# EAGLE design main (EAGLE 6.6.0)
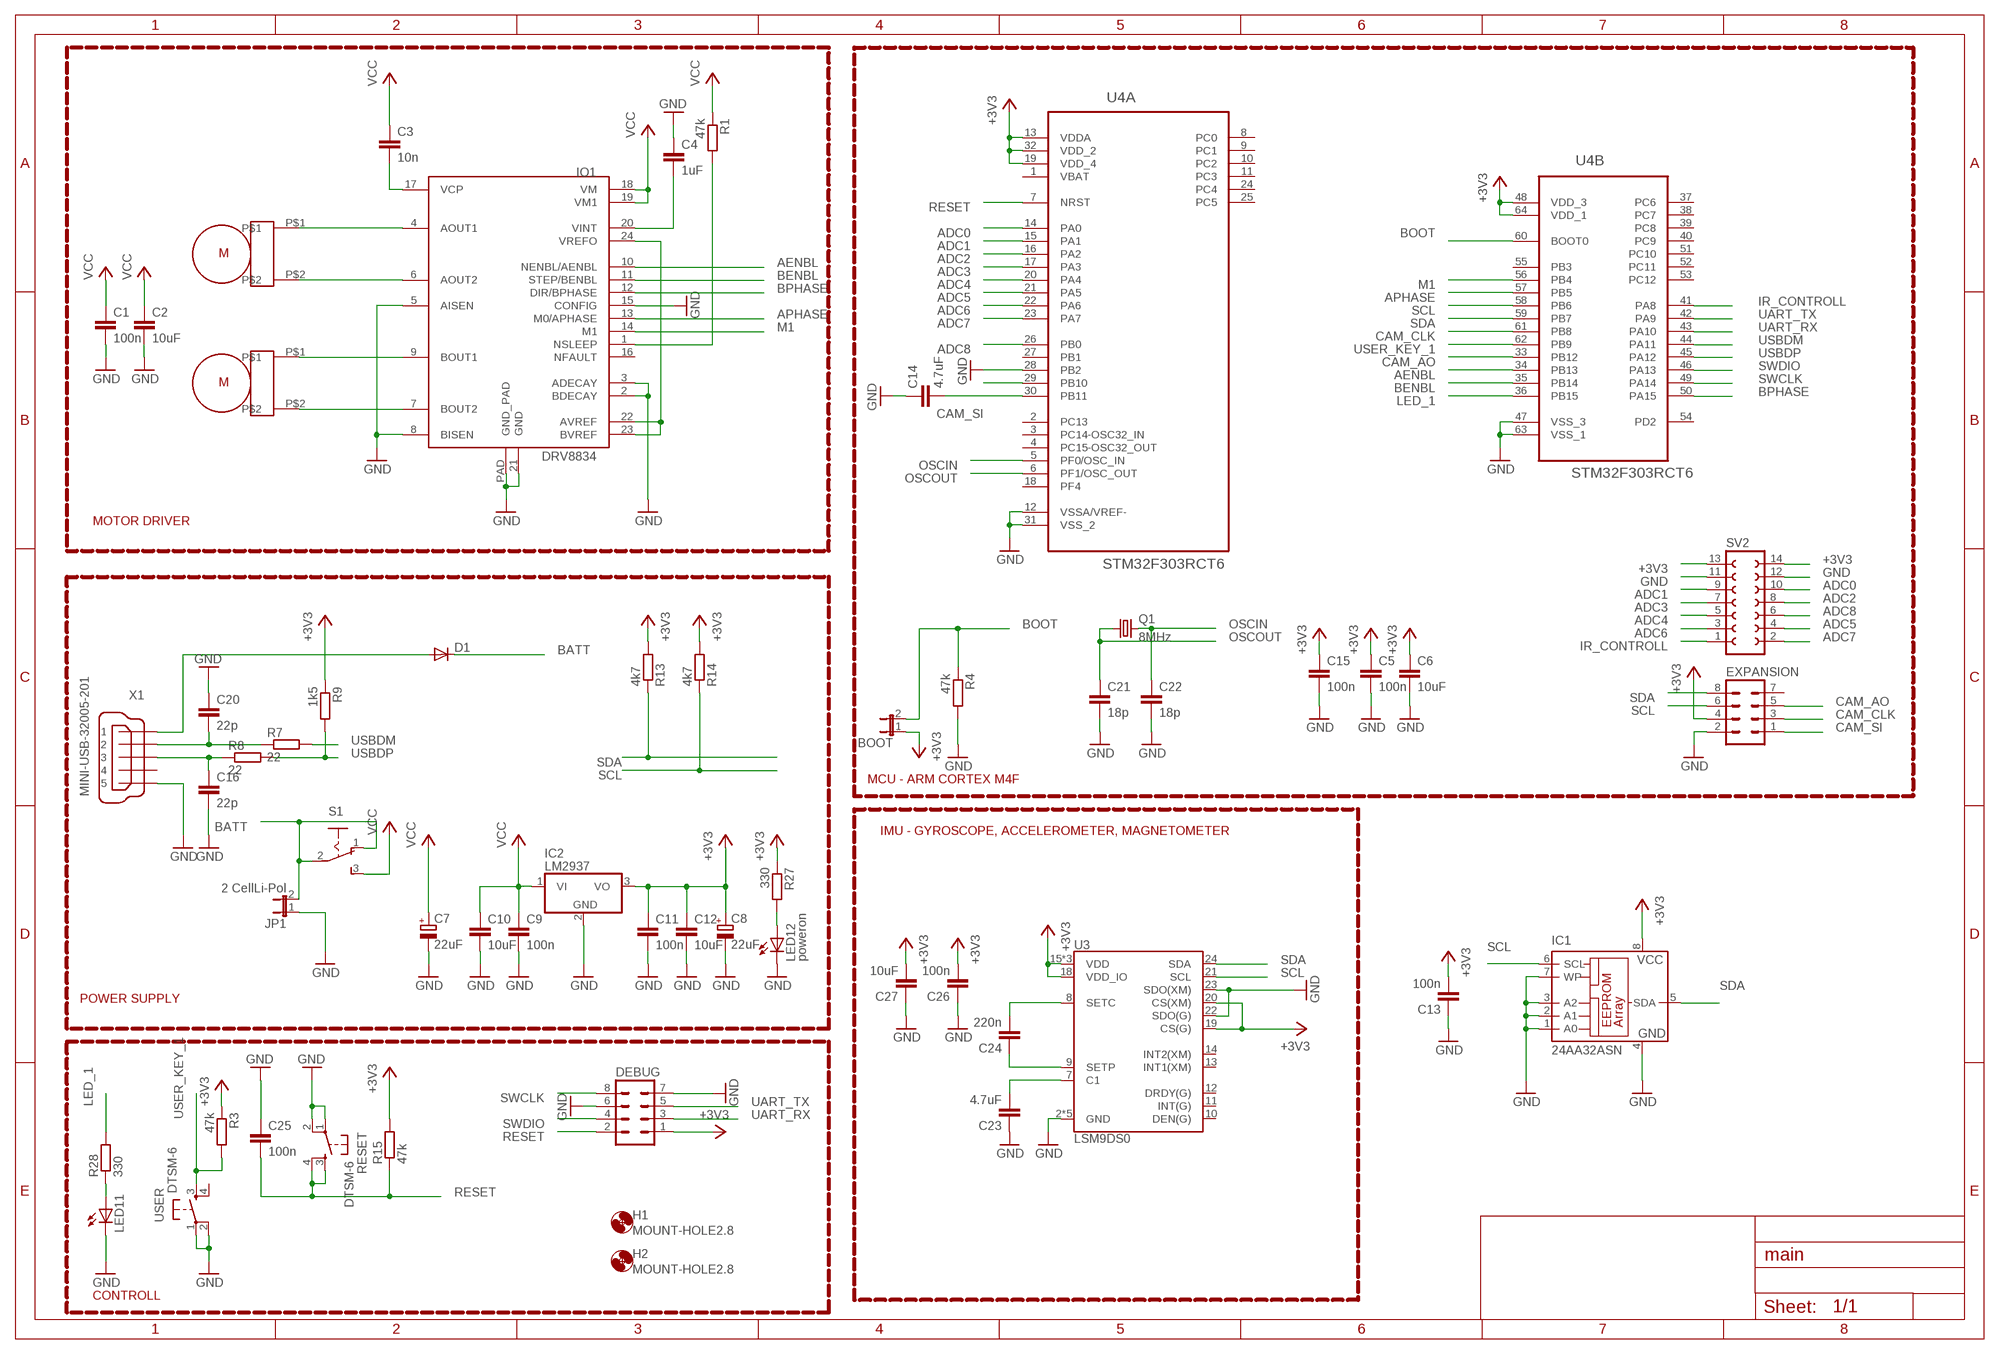
[diagram p0: schematic, sheet 1]

## Parts
BOOT  JP1E  [JP1]
C1  100n  C-EUC1206  [C1206]
C2  10uF  C-EUC1206  [C1206]
C3  10n  C-EUC1206  [C1206]
C4  1uF  C-EUC1206  [C1206]
C5  100n  C-EUC0805  [C0805]
C6  10uF  C-EUC0805  [C0805]
C7  22uF  CPOL-EU153CLV-0505  [153CLV-0505]
C8  22uF  CPOL-EU153CLV-0505  [153CLV-0505]
C9  100n  C-EUC0805  [C0805]
C10  10uF  C-EUC0805  [C0805]
C11  100n  C-EUC0805  [C0805]
C12  10uF  C-EUC0805  [C0805]
C13  100n  C-EUC0805  [C0805]
C14  4.7uF  C-EUC0805  [C0805]
C15  100n  C-EUC0805  [C0805]
C16  22p  C-EUC0805  [C0805]
C20  22p  C-EUC0805  [C0805]
C21  18p  C-EUC0805  [C0805]
C22  18p  C-EUC0805  [C0805]
C23  4.7uF  C-EUC0805  [C0805]
C24  220n  C-EUC0805  [C0805]
C25  100n  C-EUC0805  [C0805]
C26  100n  C-EUC0805  [C0805]
C27  10uF  C-EUC0805  [C0805]
D1  DIODE-SMB  [SMB]
DEBUG  MA04-2  [MA04-2]
EXPANSION  MA04-2  [MA04-2]
H1  MOUNT-HOLE2.8  [2,8]
H2  MOUNT-HOLE2.8  [2,8]
IC1  24AA32ASN  [SO-08]
IC2  LM2937  [TO263-3]
IO1  DRV8834  [DRV8834_PCK]
JP1  2 CellLi-Pol  JP1E  [JP1]
LED11  LEDCHIPLED_1206  [CHIPLED_1206]
LED12  poweron  LEDCHIPLED_1206  [CHIPLED_1206]
Q1  8MHz  CRYSTALCTS406  [CTS406]
R1  47k  R-EU_M1206  [M1206]
R3  47k  R-EU_M0805  [M0805]
R4  47k  R-EU_M0805  [M0805]
R7  22  R-EU_M0805  [M0805]
R8  22  R-EU_M0805  [M0805]
R9  1k5  R-EU_M0805  [M0805]
R13  4k7  R-EU_M0805  [M0805]
R14  4k7  R-EU_M0805  [M0805]
R15  47k  R-EU_M0805  [M0805]
R27  330  R-EU_M0805  [M0805]
R28  330  R-EU_M0805  [M0805]
RESET  DTSM-6  [DTSM-6]
S1  255SB  [255SB]
SV2  FE07-2  [FE07-2]
U3  LSM9DS0  [LGA-24]
U4  STM32F303RCT6  [QFP50P1200X1200X160-64N]
U$1  MICRO_METAL_GEAR_MOTOR  [MICRO_METAL_GEAR_MOTOR]
U$2  MICRO_METAL_GEAR_MOTOR  [MICRO_METAL_GEAR_MOTOR]
USER  DTSM-6  [DTSM-6]
X1  MINI-USB-32005-201  [32005-201]

## Nets
+3V3: BOOT.1 C5.1 C6.1 C8.+ C11.1 C12.1 C13.2 C15.1 C26.2 C27.2 DEBUG.1 EXPANSION.4 IC1.8(VCC) IC2.3(VO) R3.1 R9.1 R13.2 R14.2 R15.2 R27.1 SV2.13 SV2.14 U3.15(VDD) U3.16(VDD) U3.17(VDD) U3.18(VDD_IO) U3.19(CS(G)) U3.20(CS(XM)) U4.13(A:VDDA) U4.19(A:VDD_4) U4.32(A:VDD_2) U4.48(B:VDD_3) U4.64(B:VDD_1)
ADC0: SV2.10 U4.14(A:PA0)
ADC1: SV2.9 U4.15(A:PA1)
ADC2: SV2.8 U4.16(A:PA2)
ADC3: SV2.7 U4.17(A:PA3)
ADC4: SV2.5 U4.20(A:PA4)
ADC5: SV2.4 U4.21(A:PA5)
ADC6: SV2.3 U4.22(A:PA6)
ADC7: SV2.2 U4.23(A:PA7)
ADC8: SV2.6 U4.26(A:PB0)
AENBL: IO1.10(NENBL/AENBL) U4.34(B:PB13)
APHASE: IO1.13(M0/APHASE) U4.57(B:PB5)
BATT: D1.C JP1.2 S1.1(O) S1.2(P)
BENBL: IO1.11(STEP/BENBL) U4.35(B:PB14)
BOOT: BOOT.2 R4.1 U4.60(B:BOOT0)
BPHASE: IO1.12(DIR/BPHASE) U4.50(B:PA15)
CAM_AO: EXPANSION.5 U4.33(B:PB12)
CAM_CLK: EXPANSION.3 U4.61(B:PB8)
CAM_SI: EXPANSION.1 U4.29(A:PB10)
GND: C1.2 C2.2 C4.1 C5.2 C6.2 C7.- C8.- C9.2 C10.2 C11.2 C12.2 C13.1 C14.1 C15.2 C16.2 C20.1 C21.2 C22.2 C23.1 C25.1 C26.1 C27.1 DEBUG.6 DEBUG.7 EXPANSION.2 IC1.1(A0) IC1.2(A1) IC1.3(A2) IC1.4(GND) IC1.7(WP) IC2.2(GND) IO1.2(BDECAY) IO1.3(ADECAY) IO1.5(AISEN) IO1.8(BISEN) IO1.15(CONFIG) IO1.21(GND) IO1.PAD(GND_PAD) JP1.1 LED11.C LED12.C R4.2 RESET.1 RESET.2 SV2.11 SV2.12 U3.2(GND) U3.3(GND) U3.4(GND) U3.5(GND) U3.6(GND) U3.22(SDO(G)) U3.23(SDO(XM)) U4.12(A:VSSA/VREF-) U4.28(A:PB2) U4.31(A:VSS_2) U4.47(B:VSS_3) U4.63(B:VSS_1) USER.1 USER.2 X1.5
IR_CONTROLL: SV2.1 U4.41(B:PA8)
LED_1: R28.2 U4.36(B:PB15)
M1: IO1.14(M1) U4.56(B:PB4)
N$1: IO1.4(AOUT1) U$1.P$1
N$2: IO1.6(AOUT2) U$1.P$2
N$3: IO1.9(BOUT1) U$2.P$1
N$4: IO1.7(BOUT2) U$2.P$2
N$5: C3.2 IO1.17(VCP)
N$6: C23.2 U3.7(C1)
N$7: C24.2 U3.8(SETC)
N$8: IO1.22(AVREF) IO1.23(BVREF) IO1.24(VREFO)
N$9: IO1.1(NSLEEP) R1.2
N$13: C24.1 U3.9(SETP)
N$15: C14.2 U4.30(A:PB11)
N$22: C4.2 IO1.20(VINT)
N$23: LED12.A R27.2
N$33: LED11.A R28.1
N$55: C20.2 R7.1 X1.2
N$56: C16.1 R8.1 X1.3
N$57: D1.A X1.1
OSCIN: C22.1 Q1.3 U4.5(A:PF0/OSC_IN)
OSCOUT: C21.1 Q1.1 U4.6(A:PF1/OSC_OUT)
RESET: C25.2 DEBUG.2 R15.1 RESET.3 RESET.4 U4.7(A:NRST)
SCL: EXPANSION.6 IC1.6(SCL) R14.1 U3.21(SCL) U4.58(B:PB6)
SDA: EXPANSION.8 IC1.5(SDA) R13.1 U3.24(SDA) U4.59(B:PB7)
SWCLK: DEBUG.8 U4.49(B:PA14)
SWDIO: DEBUG.4 U4.46(B:PA13)
UART_RX: DEBUG.3 U4.43(B:PA10)
UART_TX: DEBUG.5 U4.42(B:PA9)
USBDM: R7.2 U4.44(B:PA11)
USBDP: R8.2 R9.2 U4.45(B:PA12)
USER_KEY_1: R3.2 U4.62(B:PB9) USER.3
VCC: C1.1 C2.1 C3.1 C7.+ C9.1 C10.1 IC2.1(VI) IO1.18(VM) IO1.19(VM1) R1.1 S1.3(S)
Unconnected: EXPANSION.7 IO1.16(NFAULT) U3.10(DEN(G)) U3.11(INT(G)) U3.12(DRDY(G)) U3.13(INT1(XM)) U3.14(INT2(XM)) U4.2(A:PC13) U4.3(A:PC14-OSC32_IN) U4.4(A:PC15-OSC32_OUT) U4.8(A:PC0) U4.9(A:PC1) U4.10(A:PC2) U4.11(A:PC3) U4.18(A:PF4) U4.24(A:PC4) U4.25(A:PC5) U4.27(A:PB1) U4.37(B:PC6) U4.38(B:PC7) U4.39(B:PC8) U4.40(B:PC9) U4.51(B:PC10) U4.52(B:PC11) U4.53(B:PC12) U4.54(B:PD2) U4.55(B:PB3) USER.4 X1.4

## Notes on the sheet
- MOTOR DRIVER
- MCU - ARM CORTEX M4F
- IMU - GYROSCOPE, ACCELEROMETER, MAGNETOMETER
- POWER SUPPLY
- CONTROLL

## Power pins joined to a net without a drawn wire
VBAT: U4.1(A:VBAT)

## Library data of the parts
BOOT JP1 = jumper:JP1E: JUMPER
C1-C6 C9-C16 C20-C27 = resistor:C-EU: CAPACITOR, European symbol
C7 C8 = resistor:CPOL-EU: POLARIZED CAPACITOR, European symbol
D1 = diode:DIODE-: DIODE
DEBUG EXPANSION = con-lstb:MA04-2: PIN HEADER; OC_FARNELL: unknown; OC_NEWARK: unknown
H1 H2 = holes:MOUNT-HOLE: MOUNTING HOLE with drill center marker
IC1 = microchip:24*: Serial EEPROM I2C; MF: MICROCHIP; MPN: 24AA32A-I/SN; OC_FARNELL: 1617659; OC_NEWARK: 83C5815
IC2 = linear:LM2937: LM2937-2.5, LM2937-3.3 400mA and 500mA Voltage Regulators Source: http://cache.national.com/ds/LM/LM2937-2.5.pdf
IO1 = yellow_car:DRV8834
LED11 LED12 = led:LED: LED OSRAM: - CHIPLED LG R971, LG N971, LY N971, LG Q971, LY Q971, LO R971, LY R971 LH N974, LH R974 LS Q976, LO Q976, LY Q976 LO Q996 - Hyper CHIPLED LW Q18S LB Q993, LB Q99A, LB R99A - SideLED LS A670, LO A670, LY A670, LG A670, LP A670 LB A673, LV A673, LT A673, LW A673 LH A674 LY A675 LS A676, LA A676, LO A676, LY A676, LW A676 LS A679, LY A679, LG A679 - Hyper Micro SIDELED® LS Y876, LA Y876, LO Y876, LY Y876 LT Y87S - SmartLED LW L88C, LW L88S LB L89C, LB L89S, LG L890 LS L89K, LO L89K, LY L89K LS L896, LA L896, LO L896, LY L896 - TOPLED LS T670, LO T670, LY T670, LG T670, LP T670 LSG T670, LSP T670, LSY T670, LOP T670, LYG T670 LG T671, LOG T671, LSG T671 LB T673, LV T673, LT T673, LW T673 LH T674 LS T676, LA T676, LO T676, LY T676, LB T676, LH T676, LSB T676, LW T676 LB T67C, LV T67C, LT T67C, LS T67K, LO T67K, LY T67K, LW E67C LS E67B, LA E67B, LO E67B, LY E67B, LB E67C, LV E67C, LT E67C LW T67C LS T679, LY T679, LG T679 LS T770, LO T770, LY T770, LG T770, LP T770 LB T773, LV T773, LT T773, LW T773 LH T774 LS E675, LA E675, LY E675, LS T675 LS T776, LA T776, LO T776, LY T776, LB T776 LHGB T686 LT T68C, LB T68C - Hyper Mini TOPLED® LB M676 - Mini TOPLED Santana® LG M470 LS M47K, LO M47K, LY M47K Source: http://www.osram.convergy.de LUXEON: - LUMILED® LXK2-PW12-R00, LXK2-PW12-S00, LXK2-PW14-U00, LXK2-PW14-V00 LXK2-PM12-R00, LXK2-PM12-S00, LXK2-PM14-U00 LXK2-PE12-Q00, LXK2-PE12-R00, LXK2-PE12-S00, LXK2-PE14-T00, LXK2-PE14-U00 LXK2-PB12-K00, LXK2-PB12-L00, LXK2-PB12-M00, LXK2-PB14-N00, LXK2-PB14-P00, LXK2-PB14-Q00 LXK2-PR12-L00, LXK2-PR12-M00, LXK2-PR14-Q00, LXK2-PR14-R00 LXK2-PD12-Q00, LXK2-PD12-R00, LXK2-PD12-S00 LXK2-PH12-R00, LXK2-PH12-S00 LXK2-PL12-P00, LXK2-PL12-Q00, LXK2-PL12-R00 Source: www.luxeon.com KINGBRIGHT: KA-3528ASYC Source: www.kingbright.com
Q1 = crystal:CRYSTAL: CRYSTAL; OC_FARNELL: unknown; OC_NEWARK: unknown
R1 R3 R4 R7-R9 R13-R15 R27 R28 = resistor:R-EU_: RESISTOR, European symbol
RESET USER = switch-tact:DTSM-6
S1 = switch:255SB: SLIDING SWITCH Distributor Buerklin, 11G810
SV2 = con-lsta:FE07-2: FEMALE HEADER; OC_FARNELL: unknown; OC_NEWARK: unknown
U3 = SparkFun-DigitalIC:LSM9DS0: LSM9DS0 3D Accelerometer, 3D Gyroscope, 3D Magnetomter Features: 3 acceleration channels, 3 angular rate channels, 3 magnetic field channels ±2/±4/±6/±8/±16 g linear acceleration full scale ±2/±4/±8/±12 gauss magnetic full scale ±245/±500/±2000 dps angular rate full scale 16-bit data output SPI / I2C serial interfaces Analog supply voltage 2.4 V to 3.6 V Power-down mode / low-power mode Programmable interrupt generators Embedded self-test Embedded temperature sensor Embedded FIFO Position and motion detection functions Click/double-click recognition
U4 = my_parts:STM32F303RCT6: ARM Cortex-M4 32b MCU+FPU,LQFP-64; MPN: STM32F303RCT6; OC_FARNELL: 2215112; OC_NEWARK: 46W2193; PACKAGE: LQFP-64; SUPPLIER: STMICROELECTRONICS
U$1 U$2 = pololu:MICRO_METAL_GEAR_MOTOR
X1 = con-cypressindustries:MINI-USB-: MINI USB-B Conector Source: www.cypressindustries.com; OC_FARNELL: unknown; OC_NEWARK: unknown

## Board
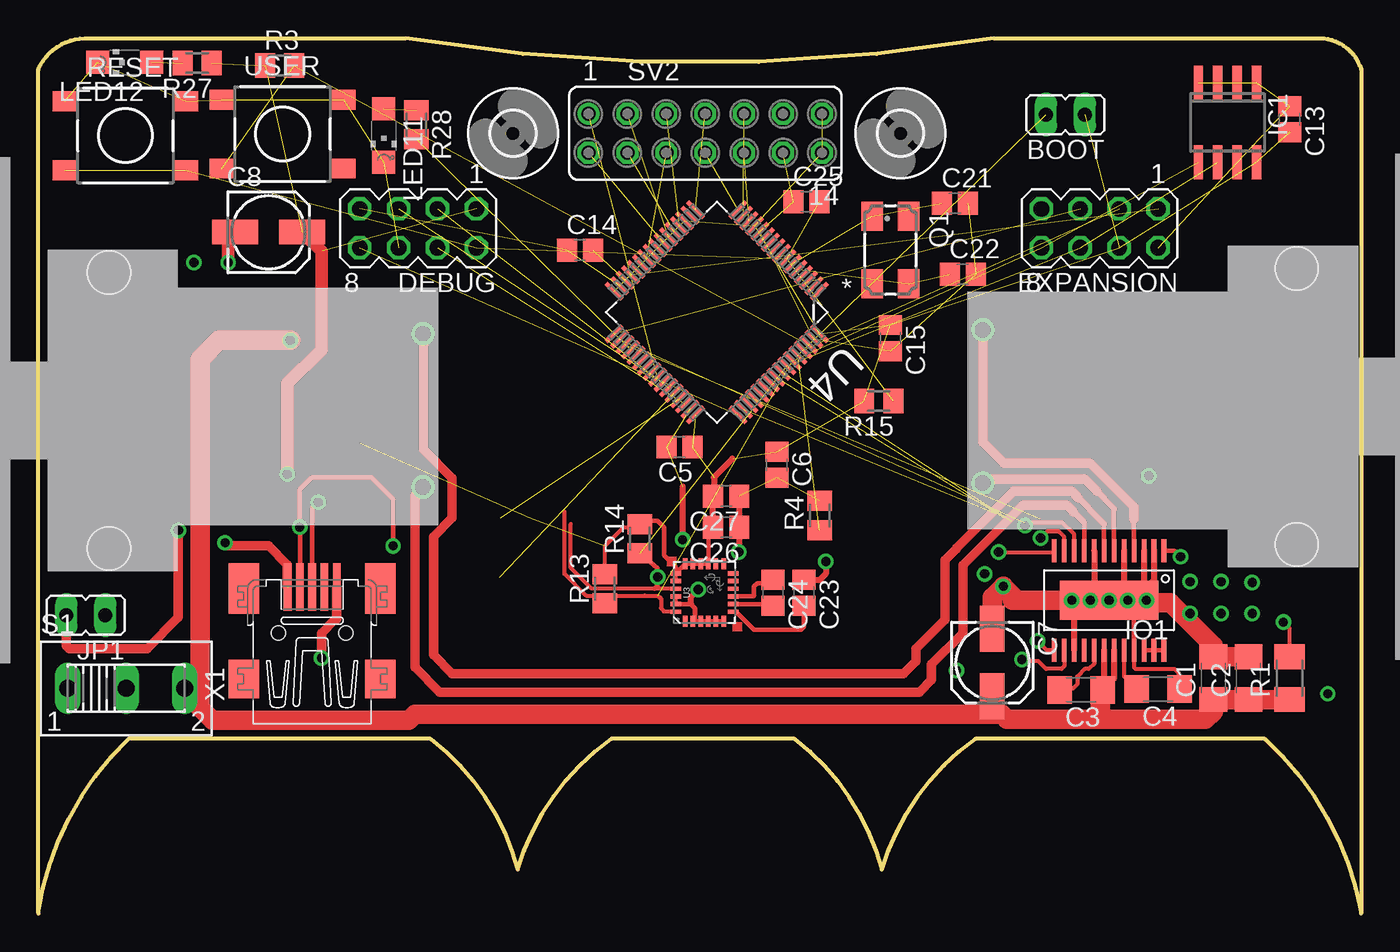
[diagram p1: board, top side]
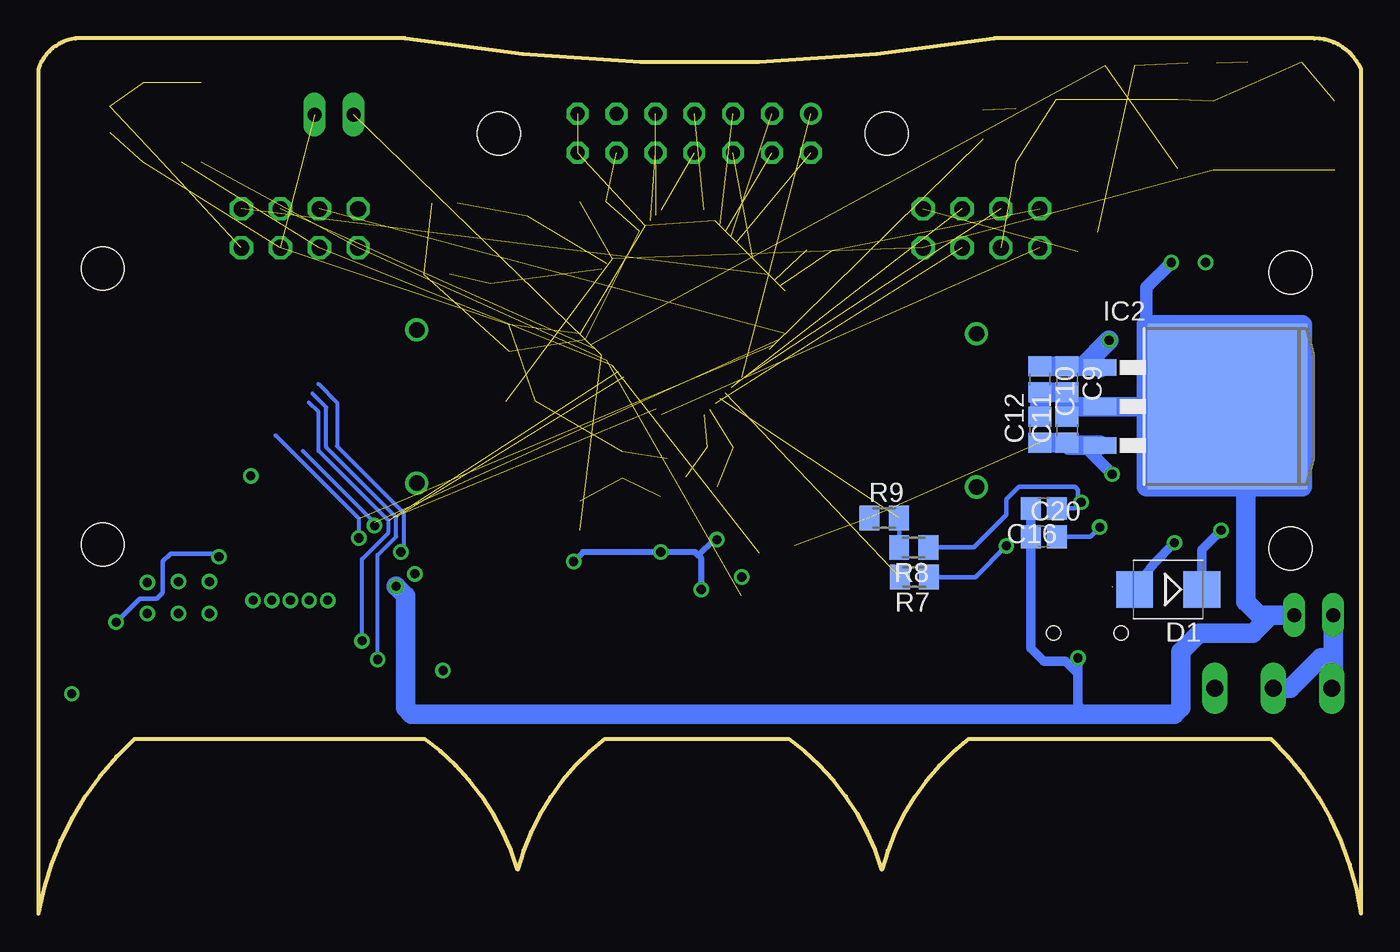
[diagram p2: board, bottom side, seen from below]

Size 86.36 x 57.1 mm. Coordinates in mm from the lower left corner, seen from the top.
Outline: 3.05,57.1 23.98,57.1 arc19 62.38,57.1 83.92,57.1 arc-66 86.36,55.07 86.36,0 arc38 80.06,11.38 61.16,11.38 arc38 55.07,2.85 arc38 49.38,11.38 37.39,11.38 arc38 31.29,2.85 arc38 25.6,11.38 5.89,11.38 arc38 0,0 0,55.07 arc-66 3.05,57.1
Copper layers (1*16): Top 0.035mm / dielectric 1.5mm / Bottom 0.035mm
Design rules "default *": minimum track width 10mil, minimum drill 24mil, track to track 10mil, track to pad 10mil, pad to pad 10mil, via to via 10mil, smd to smd 10mil, copper to edge 40mil, drill to drill 8mil, minimum pad ring 10mil, minimum via ring 8mil, stop-mask expansion 4mil, vias tented up to drill 0mil, thermal gap 10mil

### Footprints (pad centres in the part's own frame; a part is rotated, then mirrored left to right if it is on the bottom)
JP1 = drill 0.914 long: 1 0,-1.27; 2 0,1.27
C1206 = smd 1.6 x 1.8: 1 -1.4,0; 2 1.4,0
C0805 = smd 1.3 x 1.5: 1 -0.85,0; 2 0.85,0
153CLV-0505 = smd 3 x 1.6: + 2.2,0; - -2.2,0
SMB = smd 2.4 x 2.4: A 2.2,0; C -2.2,0
MA04-2 = drill 1.016 octagon: 1 -3.81,-1.27; 2 -3.81,1.27; 3 -1.27,-1.27; 4 -1.27,1.27; 5 1.27,-1.27; 6 1.27,1.27; 7 3.81,-1.27; 8 3.81,1.27
2,8 = hole 2.8: 0,0
SO-08 = smd 0.6 x 2.2: 1 -1.905,-2.6; 2 -0.635,-2.6; 3 0.635,-2.6; 4 1.905,-2.6; 5 1.905,2.6; 6 0.635,2.6; 7 -0.635,2.6; 8 -1.905,2.6
TO263-3 = smd 1.067 x 2.159: 1 -2.54,-5.791; 2 0,-5.791; 3 2.54,-5.791 | smd 10.8 x 10.41: TAB 0,2.54
DRV8834_PCK = smd 0.3 x 1.5: 1 -3.575,-3.25; 2 -2.925,-3.25; 3 -2.275,-3.25; 4 -1.625,-3.25; 5 -0.975,-3.25; 6 -0.325,-3.25; 7 0.325,-3.25; 8 0.975,-3.25; 9 1.625,-3.25; 10 2.275,-3.25; 11 2.925,-3.25; 12 3.575,-3.25; 13 3.575,3.25; 14 2.925,3.25; 15 2.275,3.25; 16 1.625,3.25; 17 0.975,3.25; 18 0.325,3.25; 19 -0.325,3.25; 20 -0.975,3.25; 21 -1.625,3.25; 22 -2.275,3.25; 23 -2.925,3.25; 24 -3.575,3.25 | smd 6.452 x 2.54: PAD 0,0
CHIPLED_1206 = smd 1.5 x 1.5: A 0,-1.75; C 0,1.75
CTS406 = smd 1.9 x 1.4: 1 -2.2,-1.2; 2 2.2,-1.2; 3 2.2,1.2; 4 -2.2,1.2
M1206 = smd 1.6 x 2: 1 -1.4,0; 2 1.4,0
M0805 = smd 1.3 x 1.6: 1 -0.95,0; 2 0.95,0
DTSM-6 = smd 1.55 x 1.3: 1 -3.975,2.25; 2 3.975,2.25; 3 -3.975,-2.25; 4 3.975,-2.25
255SB = drill 1.118 long: 1 -3.81,0; 2 0,0; 3 3.81,0
FE07-2 = drill 0.914: 1 -7.62,1.27 | drill 0.914 octagon: 2 -7.62,-1.27; 3 -5.08,1.27; 4 -5.08,-1.27; 5 -2.54,1.27; 6 -2.54,-1.27; 7 0,1.27; 8 0,-1.27; 9 2.54,1.27; 10 2.54,-1.27; 11 5.08,1.27; 12 5.08,-1.27; 13 7.62,1.27; 14 7.62,-1.27
LGA-24 = smd 0.7 x 0.29: 1 -1.875,1.25; 2 -1.875,0.75; 3 -1.875,0.25; 4 -1.875,-0.25; 5 -1.875,-0.75; 6 -1.875,-1.25; 13 1.875,-1.25; 14 1.875,-0.75; 15 1.875,-0.25; 16 1.875,0.25; 17 1.875,0.75; 18 1.875,1.25 | smd 0.29 x 0.7: 7 -1.25,-1.875; 8 -0.75,-1.875; 9 -0.25,-1.875; 10 0.25,-1.875; 11 0.75,-1.875; 12 1.25,-1.875; 19 1.25,1.875; 20 0.75,1.875; 21 0.25,1.875; 22 -0.25,1.875; 23 -0.75,1.875; 24 -1.25,1.875
QFP50P1200X1200X160-64N = smd 1.473 x 0.279: 1 -5.715,3.759; 2 -5.715,3.251; 3 -5.715,2.743; 4 -5.715,2.261; 5 -5.715,1.753; 6 -5.715,1.245; 7 -5.715,0.762; 8 -5.715,0.254; 9 -5.715,-0.254; 10 -5.715,-0.762; 11 -5.715,-1.245; 12 -5.715,-1.753; 13 -5.715,-2.261; 14 -5.715,-2.743; 15 -5.715,-3.251; 16 -5.715,-3.759; 33 5.715,-3.759; 34 5.715,-3.251; 35 5.715,-2.743; 36 5.715,-2.261; 37 5.715,-1.753; 38 5.715,-1.245; 39 5.715,-0.762; 40 5.715,-0.254; 41 5.715,0.254; 42 5.715,0.762; 43 5.715,1.245; 44 5.715,1.753; 45 5.715,2.261; 46 5.715,2.743; 47 5.715,3.251; 48 5.715,3.759 | smd 0.279 x 1.473: 17 -3.759,-5.715; 18 -3.251,-5.715; 19 -2.743,-5.715; 20 -2.261,-5.715; 21 -1.753,-5.715; 22 -1.245,-5.715; 23 -0.762,-5.715; 24 -0.254,-5.715; 25 0.254,-5.715; 26 0.762,-5.715; 27 1.245,-5.715; 28 1.753,-5.715; 29 2.261,-5.715; 30 2.743,-5.715; 31 3.251,-5.715; 32 3.759,-5.715; 49 3.759,5.715; 50 3.251,5.715; 51 2.743,5.715; 52 2.261,5.715; 53 1.753,5.715; 54 1.245,5.715; 55 0.762,5.715; 56 0.254,5.715; 57 -0.254,5.715; 58 -0.762,5.715; 59 -1.245,5.715; 60 -1.753,5.715; 61 -2.261,5.715; 62 -2.743,5.715; 63 -3.251,5.715; 64 -3.759,5.715
MICRO_METAL_GEAR_MOTOR = drill 1: P$1 -5,1; P$2 5,1 | hole 2.8: -9,21.5; 9,21.5
32005-201 = smd 3.1 x 0.5: 1 3,1.6; 2 3,0.8; 3 3,0; 4 3,-0.8; 5 3,-1.6 | smd 2.5 x 2: M1 -3,-4.45; M2 -3,4.45 | smd 3.3 x 2: M3 2.9,4.45; M4 2.9,-4.45 | hole 0.9: 0,2.2; 0,-2.2

### Placement (x,y rotation side)
BOOT  67.06,52.12 90 top
C1  76.71,15.34 90 top
C2  78.99,15.34 90 top
C3  68.07,14.58 180 top
C4  73.1,14.63 180 top
C5  41.86,30.43 180 top
C6  48.21,29.26 270 top
C7  62.28,16.36 270 top
C8  15.04,44.45 0 top
C9  19.2,34.85 270 bottom
C10  20.98,34.85 270 bottom
C11  19.2,31.55 90 bottom
C12  20.98,31.55 90 bottom
C13  81.69,51.82 270 top
C14  35.36,43.28 0 top
C15  55.63,37.54 270 top
C16  20.73,26.42 180 bottom
C20  20.73,24.59 0 bottom
C21  59.84,46.33 0 top
C22  60.35,41.71 0 top
C23  49.99,20.93 270 top
C24  47.96,20.93 270 top
C25  50.14,46.43 0 top
C26  44.91,25.2 180 top
C27  44.91,27.23 180 top
D1  12.6,21.13 180 bottom
DEBUG  24.79,44.7 180 top
EXPANSION  69.29,44.7 180 top
H1  30.99,50.9 0 top
H2  56.29,50.9 0 top
IC1  77.62,51.61 180 top
IC2  11.28,33.07 270 bottom
IO1  69.9,20.42 180 top
JP1  3.1,19.46 90 top
LED11  22.56,50.75 180 top
LED12  5.64,55.52 90 top
Q1  55.63,43.28 270 top
R1  81.69,15.34 90 top
R3  15.75,55.32 0 top
R4  51,25.96 90 top
R7  29.16,21.95 180 bottom
R8  29.21,23.88 180 bottom
R9  31.14,25.81 0 bottom
R13  36.98,21.18 90 top
R14  39.27,24.43 90 top
R15  54.86,33.43 180 top
R27  10.36,55.47 180 top
R28  24.69,51.46 270 top
RESET  5.69,50.75 0 top
S1  5.74,14.68 0 top
SV2  43.54,50.9 0 top
U3  43.48,20.93 90 top
U4  44.3,39.22 225 top
U$1  60.66,33.07 270 top
U$2  26.11,32.82 90 top
USER  15.95,50.85 0 top
X1  17.88,18.29 90 top

### Tracks (layer width: path | path; a pad name or v marks a point on that pad's centre or on a via)
+3V3  (via drill 0.6)  (20 unrouted)
  Top 0.254: 39.66,24.99 R14.2 39.08,25.2 38.2,25.2 36.98,23.98 R13.2
  Top 0.305: U3.20 U3.19 | U3.19 U3.18 U3.17 U3.16 U3.15 43.73,25.08 C26.2 | U3.19 41.61,22.6 40.84,23.37 40.84,25.2 40.44,25.6 39.49,25.6 R14.2
  Top 0.406: C26.2 C27.2 44.09,27.27 44.09,28.45 45.31,29.67
  Top 0.813: v16.26,28.65 16.26,34.54 18.49,36.78 18.49,43.2 C8.+
  Bottom 0.813: C12.1 18.3,30.7 v16.26,28.65
  Bottom 1.27: IC2.3 19.04,30.53 C11.1 C12.1
ADC0  (1 unrouted)
ADC1  (1 unrouted)
ADC2  (1 unrouted)
ADC3  (1 unrouted)
ADC4  (1 unrouted)
ADC5  (1 unrouted)
ADC6  (1 unrouted)
ADC7  (1 unrouted)
ADC8  (1 unrouted)
AENBL  (via drill 0.6)  (1 unrouted)
  Top 0.254: IO1.10 67.63,24.73 66.85,25.5 64.62,25.5 v64.41,25.3
  Bottom 0.254: v64.41,25.3 64.41,25.5 69.09,30.18
APHASE  (via drill 0.6)  (1 unrouted)
  Top 0.254: IO1.13 65.84,17.17 v65.23,17.78
  Bottom 0.254: v65.23,17.78 65.23,23.11 63.5,24.84 63.5,25.6 68.07,30.18 68.07,32.72 68.68,33.33
BATT  (via drill 0.6)
  Top 0.61: v9.14,24.99 9.14,19.3 7.11,17.27 2.03,17.27 1.83,17.48 JP1.2
  Bottom 0.61: D1.C 10.4,23.74 v9.14,24.99
  Bottom 1.27: JP1.2 1.83,16.66 | 1.83,16.66 1.83,14.78 S1.1 | S1.2 4.62,14.68 2.64,16.66 1.83,16.66
BENBL  (via drill 0.6)  (1 unrouted)
  Top 0.254: IO1.11 66.98,24.57 66.65,24.89 65.84,24.89 v65.43,24.49
  Bottom 0.254: v65.43,24.49 65.43,25.76 70.87,31.19
BOOT  (2 unrouted)
BPHASE  (via drill 0.6)  (1 unrouted)
  Top 0.254: 66.33,23.55 IO1.12 66.23,23.57 v62.69,23.57
  Bottom 0.254: v62.69,23.57 62.69,23.88 62.48,24.08 62.48,26.11 66.85,30.48 66.85,33.33 68.07,34.54
CAM_AO  (1 unrouted)
CAM_CLK  (1 unrouted)
CAM_SI  (1 unrouted)
GND  (via drill 0.6)  (25 unrouted)
  Top 0.254: 72.18,20.46 72.3,20.46 v72.34,20.42 | v68.68,20.42 v67.46,20.42 | IO1.21 71.53,16.05 71.63,15.95 74.17,15.95 74.42,15.7 74.42,14.71 C4.1 | 51.61,22.76 v51.41,22.96
  Top 0.305: 70.51,20.22 70.31,20.02 | 71.53,20.42 71.73,20.42 72.83,21.52 | 71.53,20.42 v71.12,20.42 71.04,20.42 70.88,20.58 | 67.97,20.32 68.07,20.42 v68.68,20.42 69.09,20.42 | 71.53,20.42 | 71.53,19.81 IO1.21 | U3.6 U3.5 U3.4 U3.3 U3.2 42.88,19.2 42.88,19.91 42.61,20.18 U3.23 U3.22
  Top 0.406: 71.73,20.42 71.53,20.22 71.53,19.81 72.18,20.46 IO1.3 | IO1.2 72.83,21.72 71.53,20.42 | IO1.5 70.88,20.58 70.51,20.22 | IO1.15 67.63,19.98 67.97,20.32 | IO1.8 68.93,20.58 69.09,20.42 | C27.1 C26.1 45.76,23.61 v45.72,23.57 | v51.41,22.96 51.41,22.15 51,21.74 50.02,21.74 C23.1 | 42.61,20.18 42.61,20.66 v43.08,21.13 | 42.06,27.84 v42.06,24.38
  Top 0.61: X1.5 19.48,19.18 19.38,19.18 18.49,18.29 v18.49,16.66
  Top 0.813: v12.4,42.47 12.4,44.01 C8.-
  Top 1.27: 63.6,20.42 v67.46,20.42 | 69.09,20.42 63.91,20.42 v62.99,21.34 62.28,20.63 C7.- | v72.34,20.42 72.49,20.27 73.91,20.27 76.71,17.48 C1.2 C2.2
  Bottom 0.406: v51.41,22.96 50.8,23.57 v45.72,23.57 43.48,23.57 43.28,23.37 | v43.08,21.13 43.08,23.17 43.28,23.37 | v42.06,24.38 42.27,24.38 43.28,23.37
  Bottom 0.61: v18.49,16.66 18.49,15.65 | 18.49,15.65 18.49,13.61 17.88,13.01 | C16.2 C20.1 21.58,17.31 20.73,16.46 19.3,16.46 18.49,15.65
  Bottom 0.813: 14.02,38.41 14.02,40.84 v12.4,42.47
  Bottom 1.27: v62.99,21.34 62.38,20.73 62.38,13.41 61.98,13.01 17.88,13.01 12.19,13.01 11.79,13.41 11.79,17.07 10.57,18.29 7.06,18.29 5.89,19.46 | JP1.1 5.89,19.46 | 5.89,19.46 6.65,19.46 7.52,20.32 7.52,27.64 7.31,27.84 | 14.02,33.07 IC2.2 19.25,33.07 19.3,33.12 19.3,32.5 C11.2 C9.2 C10.2 C12.2 | 14.02,33.07 14.02,38.41 3.86,38.41 3.86,27.84 7.31,27.84 | 7.31,27.84 14.02,27.84 14.02,33.07
  other vias: 77.22,19.56 75.18,19.56 75.18,21.64 77.22,21.64 69.9,20.42 79.25,19.56 79.25,21.59 72.49,28.55 84.18,14.33 61.77,22.15 59.94,15.85 10.16,42.47
IR_CONTROLL  (1 unrouted)
LED_1  (1 unrouted)
M1  (via drill 0.6)  (1 unrouted)
  Top 0.254: IO1.14 66.98,16.13 66.8,15.95 65.79,15.95 65.28,16.46 64.31,16.46 v64.21,16.56
  Bottom 0.254: 68.48,33.93 67.56,33.02 67.56,30.43 62.99,25.86 62.99,24.59 64.21,23.37 v64.21,16.56
N$1
  Top 0.305: IO1.4 71.53,25.7
  Top 0.406: 71.53,25.7 71.53,25.71
  Top 0.61: 71.53,25.71 71.53,26.52 68.68,29.36 63.04,29.36 61.65,30.75 U$1.P$1
N$2
  Top 0.305: IO1.6 70.23,26.4
  Top 0.406: 70.23,26.4 69.09,27.53
  Top 0.61: 69.09,27.53 68.28,28.35 68.25,28.33 61.91,28.33 U$1.P$2
N$3
  Top 0.305: IO1.9 68.28,25.5
  Top 0.406: 68.28,25.5 67.56,26.21 67.46,26.31
  Top 0.61: 67.56,26.21 67.16,26.62 64.26,26.62 60.35,22.71 60.35,18.29 58.32,16.26 58.32,15.24 57.51,14.43 26.21,14.43 24.59,16.05 24.59,27.29 U$2.P$1
N$4
  Top 0.305: IO1.7 69.58,25.42
  Top 0.406: 69.58,25.42 67.67,27.33
  Top 0.61: 67.87,27.13 67.67,27.33 67.46,27.53 63.65,27.53 59.94,23.83 59.94,23.8 59.18,23.04 59.18,19.15 57.3,17.27 57.3,16.46 56.49,15.65 27.03,15.65 25.81,16.87 25.81,24.59 27.03,25.81 27.03,28.4 25.15,30.28 25.15,37.78 U$2.P$2
N$5
  Top 0.254: IO1.17 68.93,16.3 68.58,15.95 68.33,15.95 67.82,15.44 67.82,14.94 67.56,14.68 66.77,14.68 C3.2
N$6
  Top 0.305: U3.7 45.55,19.68 46.74,18.49 49.78,18.49 49.99,18.69 C23.2
N$7
  Top 0.305: U3.8 47.85,20.18 C24.2
N$8
  Top 0.305: IO1.24 IO1.23 IO1.22
N$9  (via drill 0.6)
  Top 0.254: R1.2 81.69,18.59 v81.28,19
  Top 0.305: IO1.1 74.17,23.67 v74.57,23.27
  Bottom 0.305: v74.57,23.27 74.78,23.47 77.72,23.47 78.23,22.96 78.23,20.93 78.64,20.52 79.76,20.52 v81.28,19
N$13
  Top 0.305: U3.9 46.69,20.68 46.74,20.73 46.74,21.34 46.94,21.54 47.71,21.54 C24.1
N$15  (1 unrouted)
N$22
  Top 0.254: IO1.20 70.88,15.46 C4.2
N$23  (1 unrouted)
N$33  (1 unrouted)
N$55  (via drill 0.6)
  Top 0.305: X1.2 17.08,25.18 v17.07,25.2 17.07,27.64 17.88,28.45 21.74,28.45 23.16,27.03 v23.16,23.98
  Bottom 0.305: C20.2 17.68,24.59 v17.07,25.2 | R7.1 25.2,21.95 v23.16,23.98
N$56  (via drill 0.6)
  Top 0.305: X1.3 17.88,26.42 v18.29,26.82
  Bottom 0.305: C16.1 18.69,26.42 v18.29,26.82 18.49,27.03 18.49,27.64 18.69,27.84 22.35,27.84 23.16,27.03 23.16,26.01 25.3,23.88 R8.1
N$57  (via drill 0.6)  (1 unrouted)
  Top 0.61: 16.26,21.31 16.26,22.76 15.04,23.98 12.4,23.98 v12.19,24.18
  Bottom 0.61: D1.A 13.58,22.79 v12.19,24.18
OSCIN  (2 unrouted)
OSCOUT  (2 unrouted)
RESET  (5 unrouted)
SCL  (via drill 0.6)  (3 unrouted)
  Top 0.254: U3.21 40.23,21.18 36.12,21.18 34.75,22.56 34.75,25.4
  Top 0.305: R14.1 40.44,22.52 v40.44,21.95 40.44,21.38 40.23,21.18
SDA  (3 unrouted)
  Top 0.254: 40.54,20.63 40.46,20.71 39.62,20.71 39.6,20.73 37.19,20.73 | 40.64,20.52 40.64,19.91 40.84,19.71 41.58,19.71 U3.24 | 37.19,20.73 35.76,20.73 34.34,22.15 34.34,26.21 | R13.1 36.98,20.52 37.19,20.73
  Top 0.305: 40.64,20.52 40.54,20.63
SWCLK  (1 unrouted)
SWDIO  (1 unrouted)
UART_RX  (1 unrouted)
UART_TX  (1 unrouted)
USBDM  (1 unrouted)
USBDP  (1 unrouted)
  Bottom 0.305: R8.2 30.16,25.78 R9.2
USER_KEY_1  (2 unrouted)
VCC  (via drill 0.6)
  Top 0.254: C7.+ 62.28,13.11 62.38,13.01
  Top 0.305: 69.58,14.43 C3.1
  Top 0.406: 10.97,20.02 10.67,20.02 10.57,20.12 | IO1.18 69.58,14.68 C3.1 70.23,15.33 IO1.19
  Top 1.27: 69.49,14.3 C3.1 69.34,14.2 69.34,12.9 69.09,12.65 | 69.09,12.65 63.25,12.65 62.89,13.01 62.38,13.01 24.59,13.01 24.18,12.6 11.38,12.6 10.57,13.41 10.57,15.04 | 69.09,12.65 76.2,12.65 76.71,13.16 C1.1 C2.1 R1.1 | S1.3 10.21,14.68 10.57,15.04 | 10.57,15.04 10.57,20.12 10.57,36.17 11.79,37.39 v16.46,37.39
  Bottom 1.27: IC2.1 17.16,35.7 C9.1 C10.1 18.15,35.7 v16.46,37.39
(copper drawn outside any net)
  shapes: Top area x2